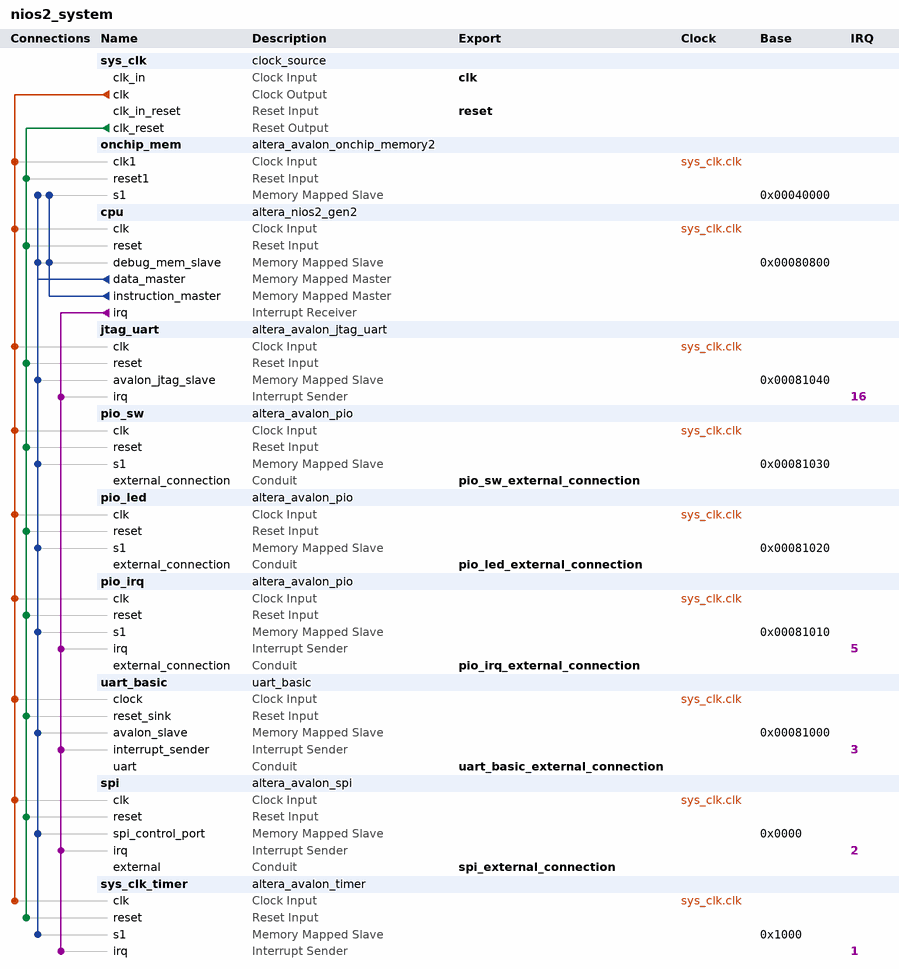
[diagram p0: system contents]
# Platform Designer (Qsys) system nios2_system, MAX 10 10M50DAF484C7G
# Parameters at their usual value, and those the tool derives, are not listed.
package require -exact qsys 18.1
create_system nios2_system
set_project_property DEVICE_FAMILY {MAX 10}
set_project_property DEVICE 10M50DAF484C7G

add_instance sys_clk clock_source 18.1
set_instance_parameter_value sys_clk clockFrequency 50000000

add_instance onchip_mem altera_avalon_onchip_memory2 18.1
set_instance_parameter_value onchip_mem dataWidth 32
set_instance_parameter_value onchip_mem dualPort false
set_instance_parameter_value onchip_mem initMemContent false
set_instance_parameter_value onchip_mem initializationFileName onchip_mem.hex
set_instance_parameter_value onchip_mem memorySize 153600

add_instance cpu altera_nios2_gen2 18.1
set_instance_parameter_value cpu dcache_size 2048
set_instance_parameter_value cpu exceptionSlave onchip_mem.s1
set_instance_parameter_value cpu icache_size 4096
set_instance_parameter_value cpu impl Tiny
set_instance_parameter_value cpu resetSlave onchip_mem.s1

add_instance jtag_uart altera_avalon_jtag_uart 18.1
set_instance_parameter_value jtag_uart readIRQThreshold 16
set_instance_parameter_value jtag_uart simInteractiveOptions NO_INTERACTIVE_WINDOWS
set_instance_parameter_value jtag_uart writeIRQThreshold 16

add_instance pio_sw altera_avalon_pio 18.1
set_instance_parameter_value pio_sw direction Input
set_instance_parameter_value pio_sw width 10

add_instance pio_led altera_avalon_pio 18.1
set_instance_parameter_value pio_led direction Output
set_instance_parameter_value pio_led width 10

add_instance pio_irq altera_avalon_pio 18.1
set_instance_parameter_value pio_irq captureEdge true
set_instance_parameter_value pio_irq direction Input
set_instance_parameter_value pio_irq edgeType FALLING
set_instance_parameter_value pio_irq generateIRQ true
set_instance_parameter_value pio_irq irqType EDGE
set_instance_parameter_value pio_irq width 3

add_instance uart_basic uart_basic 1.0
set_instance_parameter_value uart_basic GC_BAUD_RATE 115200
set_instance_parameter_value uart_basic GC_SYSTEM_CLK 50000000

add_instance spi altera_avalon_spi 18.1
set_instance_parameter_value spi clockPhase 1
set_instance_parameter_value spi clockPolarity 1
set_instance_parameter_value spi dataWidth 8
set_instance_parameter_value spi masterSPI true
set_instance_parameter_value spi numberOfSlaves 1
set_instance_parameter_value spi targetClockRate 1000000

add_instance sys_clk_timer altera_avalon_timer 18.1
set_instance_parameter_value sys_clk_timer period 1
set_instance_parameter_value sys_clk_timer periodUnits MSEC

# connections
add_connection sys_clk.clk cpu.clk clock
add_connection sys_clk.clk jtag_uart.clk clock
add_connection sys_clk.clk onchip_mem.clk1 clock
add_connection sys_clk.clk pio_irq.clk clock
add_connection sys_clk.clk pio_led.clk clock
add_connection sys_clk.clk pio_sw.clk clock
add_connection sys_clk.clk spi.clk clock
add_connection sys_clk.clk sys_clk_timer.clk clock
add_connection sys_clk.clk uart_basic.clock clock
add_connection sys_clk.clk_reset cpu.reset reset
add_connection sys_clk.clk_reset jtag_uart.reset reset
add_connection sys_clk.clk_reset onchip_mem.reset1 reset
add_connection sys_clk.clk_reset pio_irq.reset reset
add_connection sys_clk.clk_reset pio_led.reset reset
add_connection sys_clk.clk_reset pio_sw.reset reset
add_connection sys_clk.clk_reset spi.reset reset
add_connection sys_clk.clk_reset sys_clk_timer.reset reset
add_connection sys_clk.clk_reset uart_basic.reset_sink reset
add_connection cpu.data_master cpu.debug_mem_slave avalon
set_connection_parameter_value cpu.data_master/cpu.debug_mem_slave baseAddress 0x00080800
add_connection cpu.data_master jtag_uart.avalon_jtag_slave avalon
set_connection_parameter_value cpu.data_master/jtag_uart.avalon_jtag_slave baseAddress 0x00081040
add_connection cpu.data_master onchip_mem.s1 avalon
set_connection_parameter_value cpu.data_master/onchip_mem.s1 baseAddress 0x00040000
add_connection cpu.data_master pio_irq.s1 avalon
set_connection_parameter_value cpu.data_master/pio_irq.s1 baseAddress 0x00081010
add_connection cpu.data_master pio_led.s1 avalon
set_connection_parameter_value cpu.data_master/pio_led.s1 baseAddress 0x00081020
add_connection cpu.data_master pio_sw.s1 avalon
set_connection_parameter_value cpu.data_master/pio_sw.s1 baseAddress 0x00081030
add_connection cpu.data_master spi.spi_control_port avalon
set_connection_parameter_value cpu.data_master/spi.spi_control_port baseAddress 0x0000
add_connection cpu.data_master sys_clk_timer.s1 avalon
set_connection_parameter_value cpu.data_master/sys_clk_timer.s1 baseAddress 0x1000
add_connection cpu.data_master uart_basic.avalon_slave avalon
set_connection_parameter_value cpu.data_master/uart_basic.avalon_slave baseAddress 0x00081000
add_connection cpu.instruction_master cpu.debug_mem_slave avalon
set_connection_parameter_value cpu.instruction_master/cpu.debug_mem_slave baseAddress 0x00080800
add_connection cpu.instruction_master onchip_mem.s1 avalon
set_connection_parameter_value cpu.instruction_master/onchip_mem.s1 baseAddress 0x00040000
add_connection cpu.irq jtag_uart.irq interrupt
set_connection_parameter_value cpu.irq/jtag_uart.irq irqNumber 16
add_connection cpu.irq pio_irq.irq interrupt
set_connection_parameter_value cpu.irq/pio_irq.irq irqNumber 5
add_connection cpu.irq spi.irq interrupt
set_connection_parameter_value cpu.irq/spi.irq irqNumber 2
add_connection cpu.irq sys_clk_timer.irq interrupt
set_connection_parameter_value cpu.irq/sys_clk_timer.irq irqNumber 1
add_connection cpu.irq uart_basic.interrupt_sender interrupt
set_connection_parameter_value cpu.irq/uart_basic.interrupt_sender irqNumber 3

# exported interfaces
add_interface clk clock sink
set_interface_property clk EXPORT_OF sys_clk.clk_in
add_interface pio_irq_external_connection conduit end
set_interface_property pio_irq_external_connection EXPORT_OF pio_irq.external_connection
add_interface pio_led_external_connection conduit end
set_interface_property pio_led_external_connection EXPORT_OF pio_led.external_connection
add_interface pio_sw_external_connection conduit end
set_interface_property pio_sw_external_connection EXPORT_OF pio_sw.external_connection
add_interface reset reset sink
set_interface_property reset EXPORT_OF sys_clk.clk_in_reset
add_interface spi_external_connection conduit end
set_interface_property spi_external_connection EXPORT_OF spi.external
add_interface uart_basic_external_connection conduit end
set_interface_property uart_basic_external_connection EXPORT_OF uart_basic.uart

set_interconnect_requirement {$system} qsys_mm.clockCrossingAdapter HANDSHAKE
set_interconnect_requirement {$system} qsys_mm.enableEccProtection FALSE
set_interconnect_requirement {$system} qsys_mm.insertDefaultSlave FALSE
set_interconnect_requirement {$system} qsys_mm.maxAdditionalLatency 1

save_system nios2_system.qsys
